# Altium schematic sheet sheet1.SchDoc: Домофон
size 420 x 297 mm; Date: 05.12.22; ApprovedBy: Беспалов; CheckedBy: Лустгартен; Author: Юденко; CompanyName: МИЭТ; Engineer: Парфенов; Organization: МИЭТ; DocumentNumber: МИЭТ.000000.001; Revision: Ухандеев; SheetNumber: 1; SheetTotal: 2
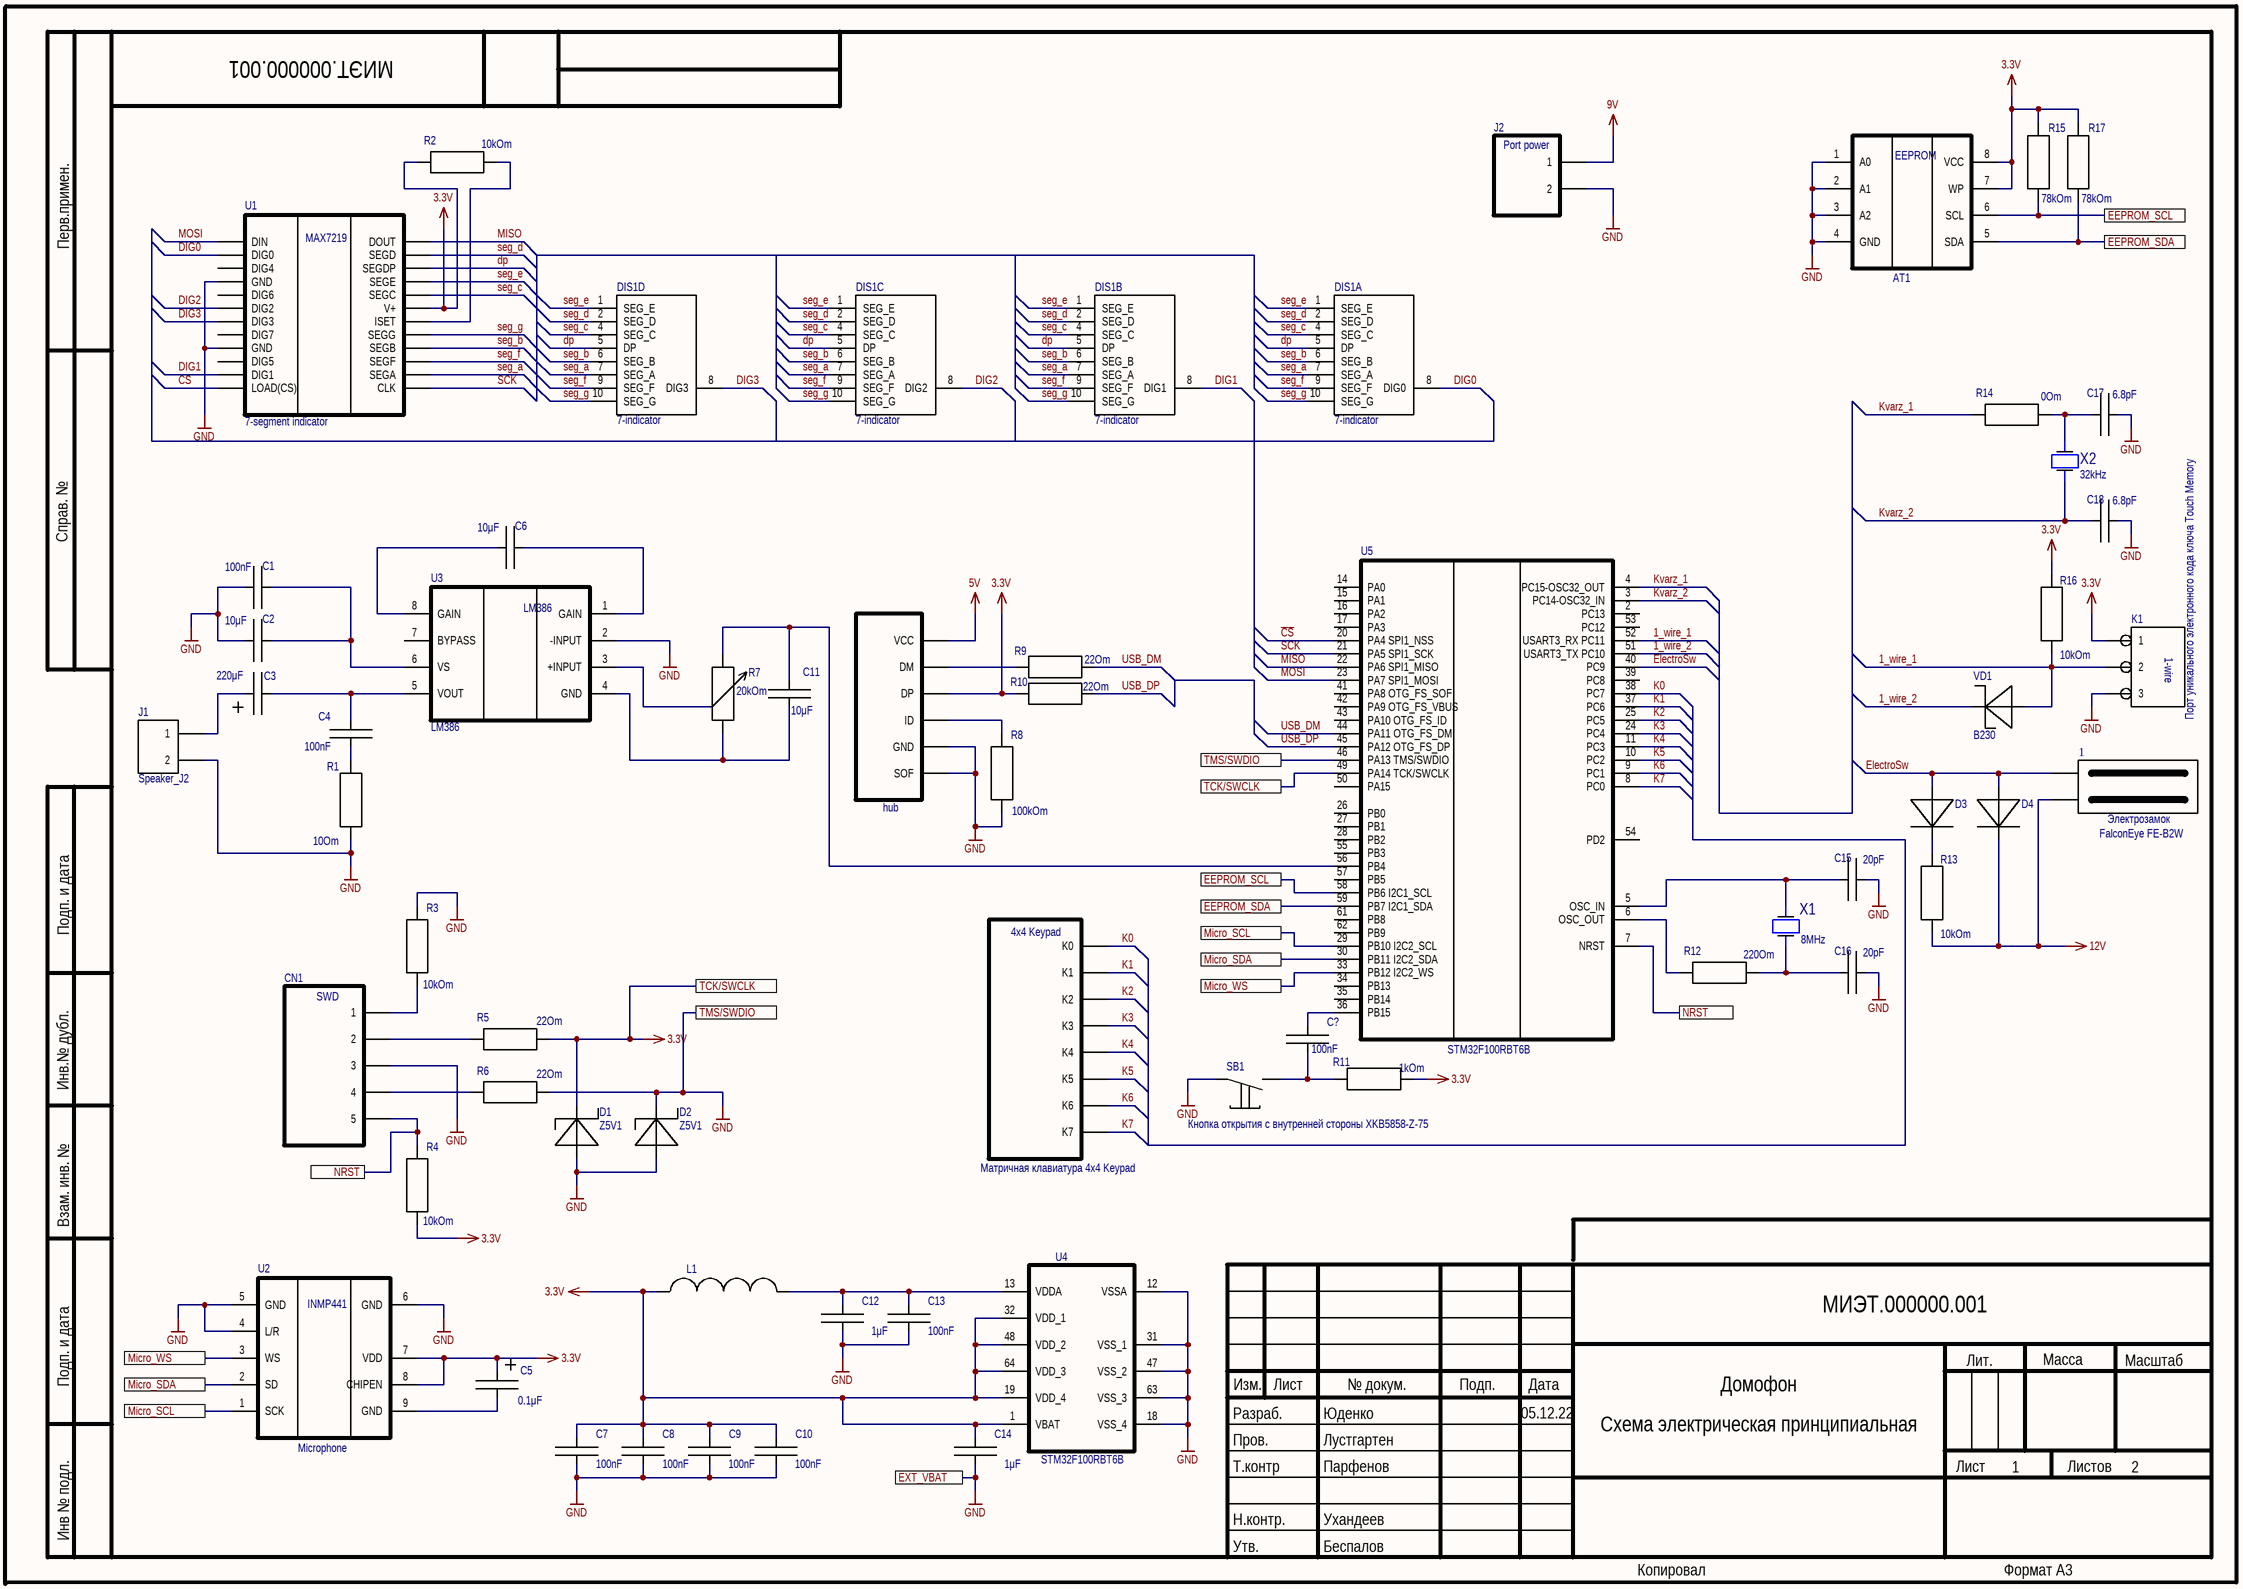
[diagram p0: sheet1.SchDoc]

## Parts
1  Электрозамок
*1  (no value)
*2  Matrix Keyboard  (value not drawn)
AT1  (no value)
C1  value 100nF  (hidden comment: 100nFФ ±* * * *, *)
C2  value 10μF  (hidden comment: 10μFФ ±* * * *, *)
C3  value 220μF  (hidden comment: 220μFФ ±* 6.3V * *, *)
C4  value 100nF  (hidden comment: 100nFФ ±* * * *, *)
C5  value 0.1μF  (hidden comment: 0.1μFФ ±* 6.3V * *, *)
C6  value 10μF  (hidden comment: 10μFФ ±* * * *, *)
C7  value 100nF  (hidden comment: 100nFФ ±* * * *, *)
C8  value 100nF  (hidden comment: 100nFФ ±* * * *, *)
C9  value 100nF  (hidden comment: 100nFФ ±* * * *, *)
C10  value 100nF  (hidden comment: 100nFФ ±* * * *, *)
C11  value 10μF  (hidden comment: 10μFФ ±* * * *, *)
C12  value 1μF  (hidden comment: 1μFФ ±* * * *, *)
C13  value 100nF  (hidden comment: 100nFФ ±* * * *, *)
C14  value 1μF  (hidden comment: 1μFФ ±* * * *, *)
C15  value 20pF  (hidden comment: 20pFФ ±* * * *, *)
C16  value 20pF  (hidden comment: 20pFФ ±* * * *, *)
C17  value 6.8pF  (hidden comment: 6.8pFФ ±* * * *, *)
C18  value 6.8pF  (hidden comment: 6.8pFФ ±* * * *, *)
C?  value 100nF  (hidden comment: 100nFФ ±* * * *, *)
CN1  (no value)
D1  Z5V1
D2  Z5V1
D3  (no value)
D4  (no value)
DIS1  7-indicator  (parts A,B,C,D of 4)
J1  Speaker_J2
J2  (no value)
K1  (no value)
L1  15mkH  (value not drawn)
R1  value 10Om
R2  value 10kOm
R3  value 10kOm
R4  value 10kOm
R5  value 22Om
R6  value 22Om
R7  20kOm
R8  value 100kOm
R9  value 22Om
R10  value 22Om
R11  value 1kOm
R12  value 220Om
R13  value 10kOm
R14  value 0Om
R15  value 78kOm
R16  value 10kOm
R17  value 78kOm
SB1  (no value)
U1  7-segment indicator
U2  Microphone
U3  LM386
U4  (no value)
U5  (no value)
VD1  B230
X1  value 8МHz  (hidden comment: oscillator)
X2  value 32kHz  (hidden comment: oscillator)

## Ports
EEPROM_SCL, EEPROM_SDA, EXT_VBAT, Micro_SCL, Micro_SDA, Micro_WS, NRST, TCK/SWCLK, TMS/SWDIO

## Nets
3.3V: *1.109(DP) AT1.7(WP) AT1.8(VCC) C5.1 C7.2 C8.2 C9.2 C10.2 C14.2 D1.11 K1.76(1) L1.8 R2.2 R4.2 R5.1 R10.2 R11.1 R15.1 R16.2 R17.1 U1.101(V+) U2.7(VDD) U2.8(CHIPEN) U4.1(VBAT) U4.19(VDD_4) U4.32(VDD_1) U4.48(VDD_2) U4.64(VDD_3) U5.49(PA14_TCK/SWCLK) ; port TCK/SWCLK
5V: *1.106(VCC)
9V: J2.83(1)
12V: 1.73 D4.11 R13.1
GND: *1.105(SOF) *1.107(GND) AT1.1(A0) AT1.2(A1) AT1.3(A2) AT1.4(GND) C1.1 C2.1 C7.1 C8.1 C9.1 C10.1 C12.1 C13.1 C14.1 C15.1 C16.1 C17.1 C18.1 CN1.67(3) D1.10 D2.10 D2.11 J1.88(2) J2.84(2) K1.78(3) R1.1 R3.1 R6.1 R8.2 SB1.78 U1.95(GND) U1.96(GND) U2.4(L/R) U2.5(GND) U2.6(GND) U3.2(-INPUT) U4.12(VSSA) U4.18(VSS_4) U4.31(VSS_1) U4.47(VSS_2) U4.63(VSS_3) U5.46(PA13_TMS/SWDIO) ; port TMS/SWDIO, port EXT_VBAT
1_wire_1: K1.77(2) R16.1 U5.52(USART3_RX_PC11) VD1.10
1_wire_2: U5.51(USART3_TX_PC10) VD1.11
~{CS}: U1.108(LOAD(CS)) U5.20(PA4_SPI1_NSS)
DIG0: DIS1.8(DIG0) U1.93(DIG0)
DIG1: DIS1.8(DIG1) U1.94(DIG1)
DIG2: DIS1.8(DIG2) U1.95(DIG2)
DIG3: DIS1.8(DIG3) U1.96(DIG3)
dp: DIS1.5(DP) U1.98(DIG5)
EEPROM_SCL: AT1.6(SCL) R15.2 U5.58(PB6_I2C1_SCL) ; port EEPROM_SCL
EEPROM_SDA: AT1.5(SDA) R17.2 U5.59(PB7_I2C1_SDA) ; port EEPROM_SDA
ElectroSw: 1.74 D3.10 D4.10 U5.40(PC9)
K0: *2.82(K0) U5.38(PC7)
K1: *2.83(K1) U5.37(PC6)
K2: *2.84(K2) U5.25(PC5)
K3: *2.85(K3) U5.24(PC4)
K4: *2.86(K4) U5.11(PC3)
K5: *2.87(K5) U5.10(PC2)
K6: *2.88(K6) U5.9(PC1)
K7: *2.89(K7) U5.8(PC0)
Kvarz_1: R14.2 U5.4(PC15-OSC32_OUT)
Kvarz_2: C18.2 U5.3(PC14-OSC32_IN) X2.145
Micro_SCL: U2.1(SCK) U5.29(PB10_I2C2_SCL) ; port Micro_SCL
Micro_SDA: U2.2(SD) U5.30(PB11_I2C2_SDA) ; port Micro_SDA
Micro_WS: U2.3(WS) U5.33(PB12_I2C2_WS) ; port Micro_WS
MISO: U1.96(DOUT) U5.22(PA6_SPI1_MISO)
MOSI: U1.92(DIN) U5.23(PA7_SPI1_MOSI)
NRST: CN1.69(5) R4.1 U5.7(NRST) ; port NRST
SCK: U1.107(CLK) U5.21(PA5_SPI1_SCK)
seg_a: DIS1.7(SEG_A) U1.106(SEGA)
seg_b: DIS1.6(SEG_B) U1.104(SEGB)
seg_c: DIS1.4(SEG_C) U1.100(DIG7)
seg_d: DIS1.2(SEG_D) U1.97(DIG4)
seg_e: DIS1.1(SEG_E) U1.99(DIG6)
seg_f: DIS1.9(SEG_F) U1.105(SEGF)
seg_g: DIS1.10(SEG_G) U1.103(SEGG)
USB_DM: R9.1 U5.44(PA11_OTG_FS_DM)
USB_DP: R10.1 U5.45(PA12_OTG_FS_DP)
Net*1_107: *1.107(ID) R8.1
Net*1_108: *1.108(DM) R9.2
NetC1_2: C1.2 C2.2 U3.6(VS)
NetC3_1: C3.1 J1.87(1)
NetC3_2: C3.2 C4.2 U3.5(VOUT)
NetC4_1: C4.1 R1.2
NetC5_2: C5.2 U2.9(GND)
NetC6_1: C6.1 U3.8(GAIN)
NetC6_2: C6.2 U3.1(GAIN)
NetC11_1: C11.1 R7.107 U3.4(GND)
NetC11_2: C11.2 R7.106 U5.56(PB4)
NetC12_2: C12.2 C13.2 L1.9 U4.13(VDDA)
NetC15_2: C15.2 U5.5(OSC_IN) X1.145
NetC16_2: C16.2 R12.1 X1.145
NetC17_2: C17.2 R14.1 X2.145
NetC?_1: C?.1 R11.2 SB1.77
NetC?_2: C?.2 U5.36(PB15)
NetCN1_65: CN1.65(1) R3.2
NetCN1_66: CN1.66(2) R5.2
NetCN1_68: CN1.68(4) R6.2
NetD3_11: D3.11 R13.2
NetR2_1: R2.1 U1.102(ISET)
NetR7_108: R7.108 U3.3(+INPUT)
NetR12_2: R12.2 U5.6(OSC_OUT)

Not connected (* = marked no-connect by the designer): U3 7(BYPASS); U5 2(PC13) 14(PA0) 15(PA1) 16(PA2) 17(PA3) 26(PB0) 27(PB1) 28(PB2) 34(PB13) 35(PB14) 39(PC8) 41(PA8_OTG_FS_SOF) 42(PA9_OTG_FS_VBUS) 43(PA10_OTG_FS_ID) 50(PA15) 53(PC12) 54(PD2) 55(PB3) 57(PB5) 61(PB8) 62(PB9)

## Notes on the sheet
- Порт уникального электронного кода ключа Touch Memory
- (near *1) hub
- (near 1) FalconEye FE-B2W
- Кнопка открытия с внутренней стороны XKB5858-Z-75
- (near *2) Матричная клавиатура 4x4 Keypad
- Перв.примен.
- Справ. №
- Подп. и дата
- Инв.№ дубл.
- Взам. инв. №
- Изм.
- Лист
- № докум.
- Подп.
- Дата
- Лит.
- Масса
- Масштаб
- Пров.
- Т.контр
- Разраб.
- Схема электрическая принципиальная
- 1
- Листов
- Инв № подл.
- Н.контр.
- Утв.
- Копировал
- Формат А3
- (in symbol 7-segment indicator) MAX7219
- (in symbol CN) SWD
- (in symbol Matrix Keyboard) 4x4 Keypad
- (in symbol Microphone) INMP441
- (in symbol Power) Port power
- (in symbol STM32_power) STM32F100RBT6B
- (in symbol STM_main) STM32F100RBT6B

## Library data of the parts
*1 = разъём HUB
AT1 = EEPROM
C1 C2 C4 C6-C18 C? = C: Company: *; PartNumber: *; Tolerance: *; Voltage: *; Type: *; Package: *
C3 C5 = C+: Company: *; Tolerance: *; Voltage: 6.3V; Type: *; PartNumber: *; Package: *
CN1 = CN
D3 D4 = diode
J2 = Power
K1 = 1-wire
L1 = L: Value: 15mkH
R1-R6 R8-R17 = R: Company: *; PartNumber: *; Package: *; Tolerance: *
R7 = R_podstr
SB1 = button
U4 = STM32_power
U5 = STM_main
VD1 = diode_shottki